# Altium schematic sheet MF Thermistors.SchDoc
size A4; DrawnBy: Lorna Lan, Dylan Vogel; DocumentNumber: 17; Revision: v4.1; SheetNumber: 17; SheetTotal: 20
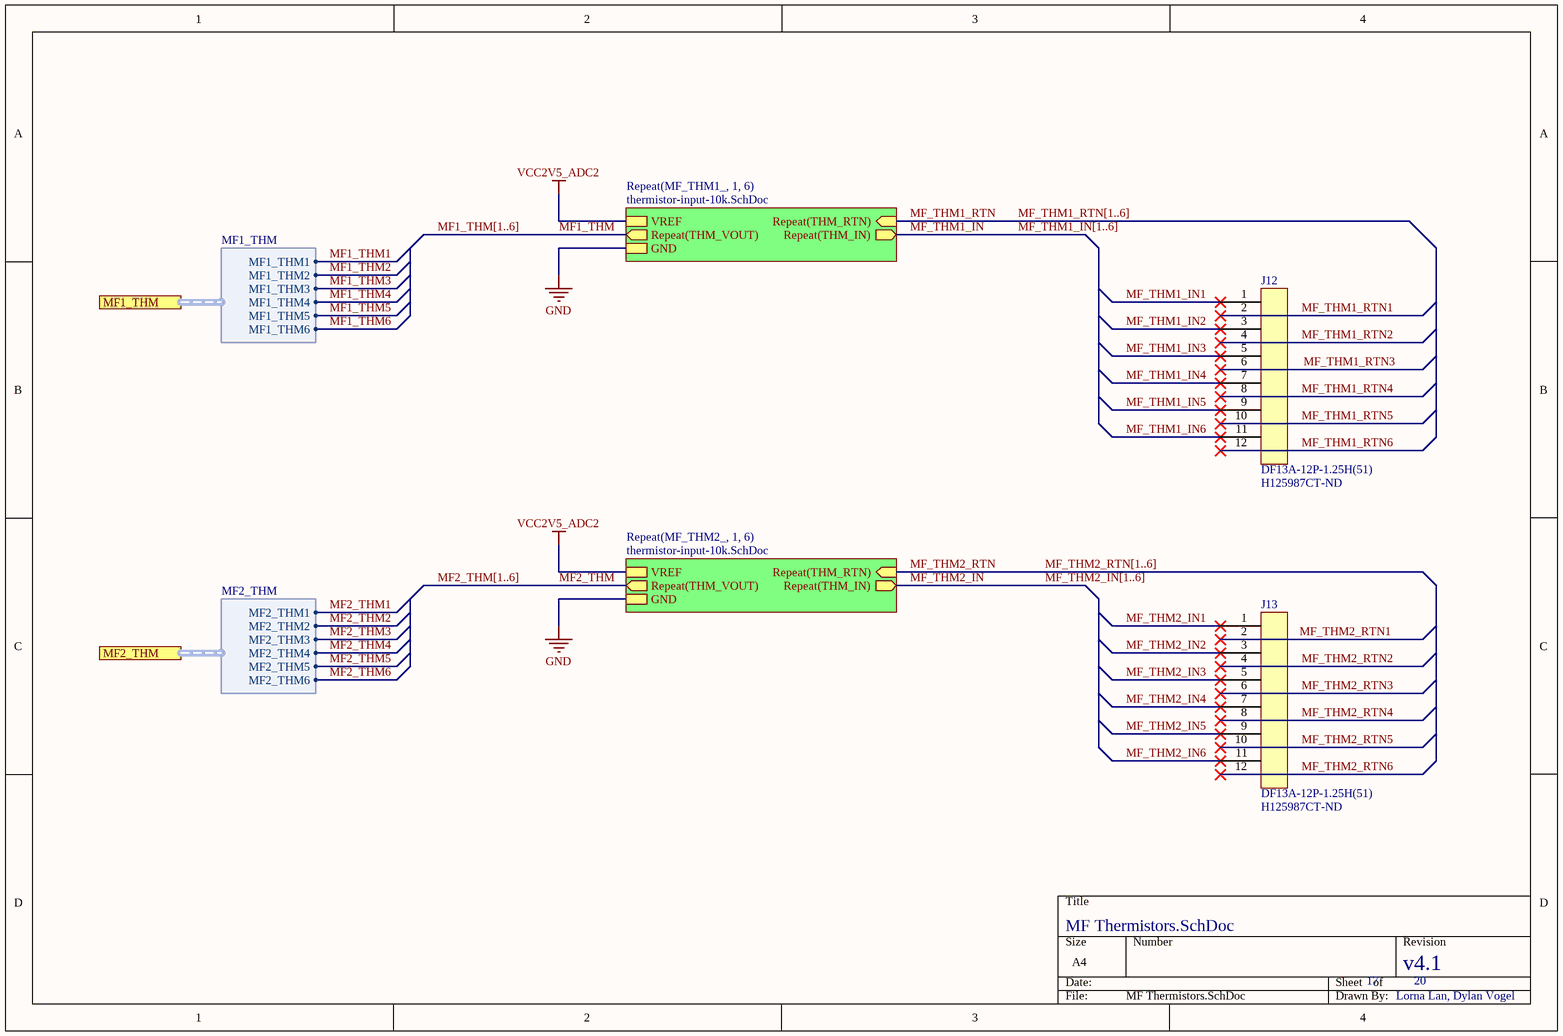
[diagram p0: MF Thermistors.SchDoc]

## Parts
J12  DF13A-12P-1.25H(51)  Supplier Part Number 1: H125987CT-ND  [DF13A-12P-1.25H(51)]
J13  DF13A-12P-1.25H(51)  Supplier Part Number 1: H125987CT-ND  [DF13A-12P-1.25H(51)]

## Sub-sheets
Repeat(MF_THM1_, 1, 6) = thermistor-input-10k.SchDoc: Repeat(THM_IN) (out), Repeat(THM_RTN) (in), Repeat(THM_VOUT) (out), GND, VREF
Repeat(MF_THM2_, 1, 6) = thermistor-input-10k.SchDoc: Repeat(THM_IN) (out), Repeat(THM_RTN) (in), Repeat(THM_VOUT) (out), GND, VREF

## Ports
MF1_THM (harness MF1_THM), MF2_THM (harness MF2_THM)

## Harnesses
MF1_THM: MF1_THM1, MF1_THM2, MF1_THM3, MF1_THM4, MF1_THM5, MF1_THM6
MF2_THM: MF2_THM1, MF2_THM2, MF2_THM3, MF2_THM4, MF2_THM5, MF2_THM6

## Nets
GND: sheet Repeat(MF_THM1_, 1, 6)/GND, sheet Repeat(MF_THM2_, 1, 6)/GND
VCC2V5_ADC2: sheet Repeat(MF_THM1_, 1, 6)/VREF, sheet Repeat(MF_THM2_, 1, 6)/VREF
MF1_THM: sheet Repeat(MF_THM1_, 1, 6)/Repeat(THM_VOUT)
MF1_THM1: port MF1_THM.MF1_THM1
MF1_THM2: port MF1_THM.MF1_THM2
MF1_THM3: port MF1_THM.MF1_THM3
MF1_THM4: port MF1_THM.MF1_THM4
MF1_THM5: port MF1_THM.MF1_THM5
MF1_THM6: port MF1_THM.MF1_THM6
MF2_THM: sheet Repeat(MF_THM2_, 1, 6)/Repeat(THM_VOUT)
MF2_THM1: port MF2_THM.MF2_THM1
MF2_THM2: port MF2_THM.MF2_THM2
MF2_THM3: port MF2_THM.MF2_THM3
MF2_THM4: port MF2_THM.MF2_THM4
MF2_THM5: port MF2_THM.MF2_THM5
MF2_THM6: port MF2_THM.MF2_THM6
MF_THM1_IN: sheet Repeat(MF_THM1_, 1, 6)/Repeat(THM_IN)
MF_THM1_IN1: J12.1
MF_THM1_IN2: J12.3
MF_THM1_IN3: J12.5
MF_THM1_IN4: J12.7
MF_THM1_IN5: J12.9
MF_THM1_IN6: J12.11
MF_THM1_RTN: sheet Repeat(MF_THM1_, 1, 6)/Repeat(THM_RTN)
MF_THM1_RTN1: J12.2
MF_THM1_RTN2: J12.4
MF_THM1_RTN3: J12.6
MF_THM1_RTN4: J12.8
MF_THM1_RTN5: J12.10
MF_THM1_RTN6: J12.12
MF_THM2_IN: sheet Repeat(MF_THM2_, 1, 6)/Repeat(THM_IN)
MF_THM2_IN1: J13.1
MF_THM2_IN2: J13.3
MF_THM2_IN3: J13.5
MF_THM2_IN4: J13.7
MF_THM2_IN5: J13.9
MF_THM2_IN6: J13.11
MF_THM2_RTN: sheet Repeat(MF_THM2_, 1, 6)/Repeat(THM_RTN)
MF_THM2_RTN1: J13.2
MF_THM2_RTN2: J13.4
MF_THM2_RTN3: J13.6
MF_THM2_RTN4: J13.8
MF_THM2_RTN5: J13.10
MF_THM2_RTN6: J13.12

## Buses and harness runs
bus MF1_THM[1..6]
bus MF2_THM[1..6]
bus MF_THM1_IN[1..6]
bus MF_THM1_RTN[1..6]
bus MF_THM2_IN[1..6]
bus MF_THM2_RTN[1..6]

## Library data of the parts
J12 J13 = DF13A-12P-1.25H(51): 12 pos DF13 right angle surface mount connector; Manufacturer: Hirose; Current Rating: 1A; Voltage Rating: 150V; Contact Resistance: 30mR; Number of Positions: 12; Pitch: 1.25mm; Supplier 1: Digi-Key; Manufacturer Part Number: DF13A-12P-1.25H(51); Stock 1: 878; Pricing 1: 1=1.69, 10=1.536, 100=1.3167, 500=1.09726 (USD); Contact Material: Brass,Copper Alloy; Contact Plating: Gold; Housing Color: Beige; Housing Material: Polyamide; Min Operating Temperature: -35°C; Max Operating Temperature: 85°C; Contact Gender: Male; Package Quantity: 1000; Number of Rows: 1; Packaging: Tape and Reel; Max Current Rating: 1A; Termination: Solder; Number of Contacts: 12; Max Voltage Rating (AC): 150V; Orientation: Right Angle; Length: 19.65mm; Depth: 6.5mm; Radiation Hardening: No; Lead Free: Lead Free; ComponentLink1URL: http://www.mouser.com/ds/2/185/DF13_catalog-939190.pdf?src-supplier=Mouser; ComponentLink1Description: http://www.mouser.com/ds/2/185/DF13_catalog-939190.pdf?src-supplier=Mouser; ComponentLink2URL: http://www.hirose.co.jp/cataloge_hp/en_DF13_20130411.pdf?src-supplier=Future+Electronics; ComponentLink2Description: http://www.hirose.co.jp/cataloge_hp/en_DF13_20130411.pdf?src-supplier=Future+Electronics; ComponentLink3URL: https://www.verical.com/server-webapp/html/getDatasheet?partID=429813&src-supplier=Verical; ComponentLink3Description: https://www.verical.com/server-webapp/html/getDatasheet?partID=429813&src-supplier=Verical